# Altium schematic sheet PWM_Controller.SchDoc
size A4; SheetNumber: 11; SheetTotal: 12
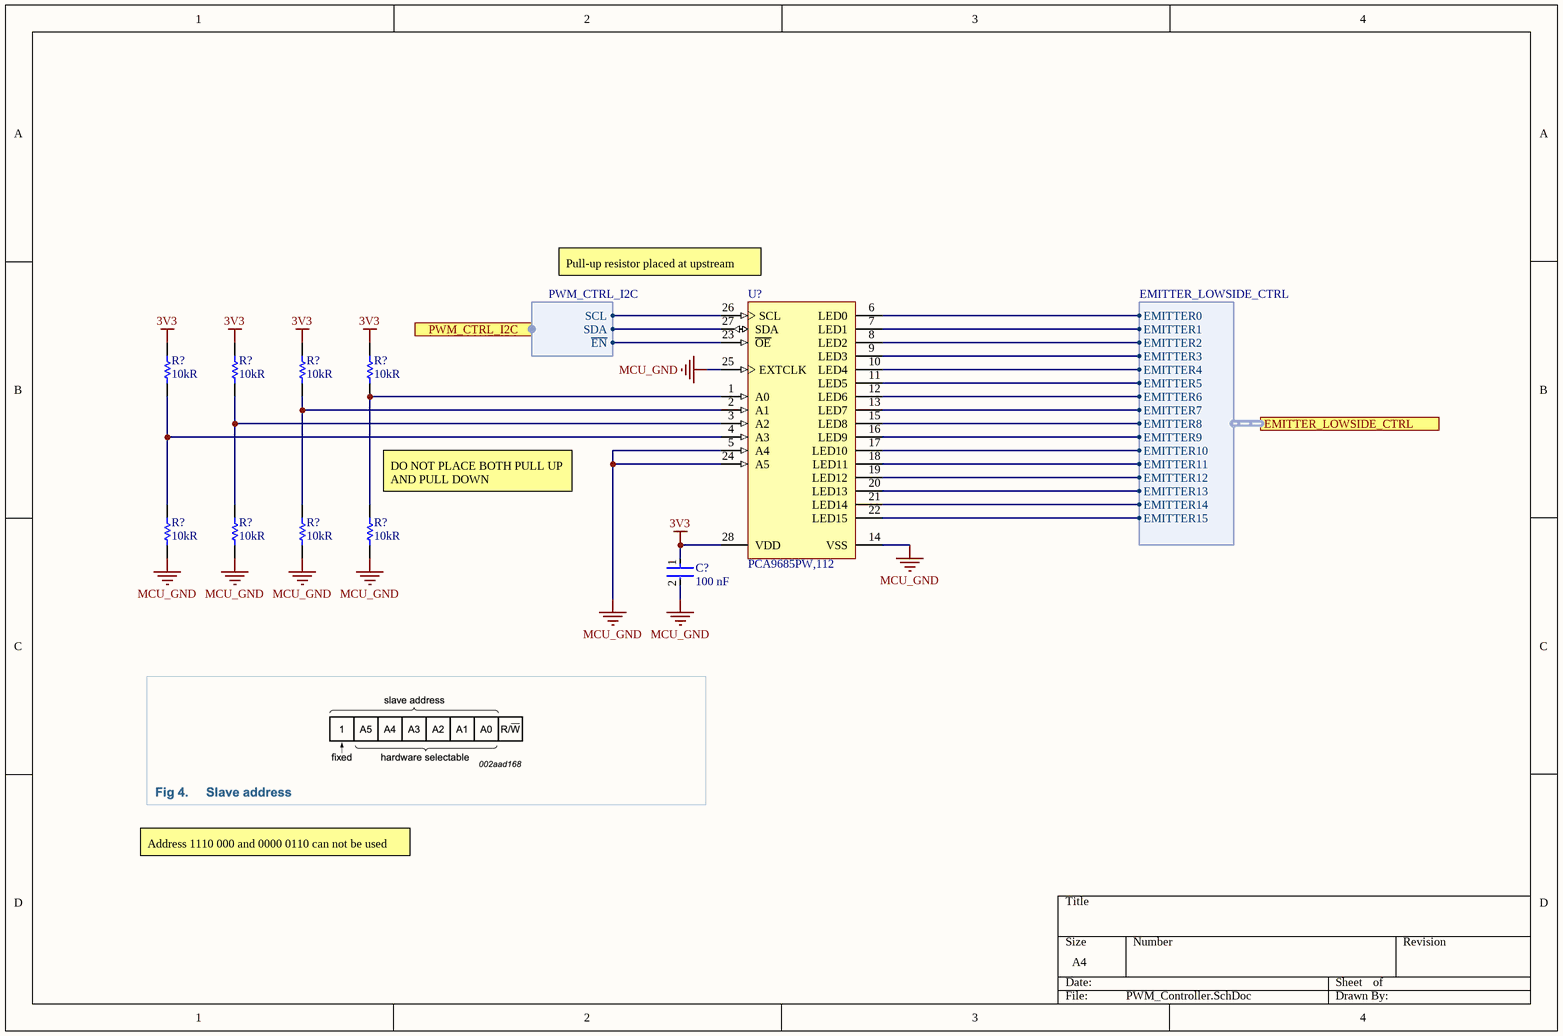
[diagram p0: PWM_Controller.SchDoc]

## Parts
(Parts that share a designator on the sheet are numbered #1, #2 ... from top to bottom, then left to right.)
C?  Capacitance: 100 nF  [FP-CC0603-DA-MFG]  (hidden comment: CC0603KRX7R7BB104)
R?#1  Resistance: 10kR  [RESC1609X50X30NL8T20]  (hidden comment: CRCW060310K0FKEA)
R?#2  Resistance: 10kR  [RESC1609X50X30NL8T20]  (hidden comment: CRCW060310K0FKEA)
R?#3  Resistance: 10kR  [RESC1609X50X30NL8T20]  (hidden comment: CRCW060310K0FKEA)
R?#4  Resistance: 10kR  [RESC1609X50X30NL8T20]  (hidden comment: CRCW060310K0FKEA)
R?#5  Resistance: 10kR  [RESC1609X50X30NL8T20]  (hidden comment: CRCW060310K0FKEA)
R?#6  Resistance: 10kR  [RESC1609X50X30NL8T20]  (hidden comment: CRCW060310K0FKEA)
R?#7  Resistance: 10kR  [RESC1609X50X30NL8T20]  (hidden comment: CRCW060310K0FKEA)
R?#8  Resistance: 10kR  [RESC1609X50X30NL8T20]  (hidden comment: CRCW060310K0FKEA)
U?  PCA9685PW,112  [SOT361-1_V]

## Ports
EMITTER_LOWSIDE_CTRL (harness EMITTER_LOWSIDE_CTRL), PWM_CTRL_I2C (harness PWM_CTRL_I2C)

## Harnesses
PWM_CTRL_I2C: SCL, SDA, ~{EN}
EMITTER_LOWSIDE_CTRL: EMITTER0, EMITTER1, EMITTER2, EMITTER3, EMITTER4, EMITTER5, EMITTER6, EMITTER7, EMITTER8, EMITTER9, EMITTER10, EMITTER11, EMITTER12, EMITTER13, EMITTER14, EMITTER15

## Nets
3V3: C?.1 R?#1.2 R?#2.2 R?#3.2 R?#4.2 U?.28(VDD)
MCU_GND: C?.2 R?#5.1 R?#6.1 R?#7.1 R?#8.1 U?.5(A4) U?.14(VSS) U?.24(A5) U?.25(EXTCLK)
NetR?#1_1: R?#1.1 R?#5.2 U?.4(A3)
NetR?#2_1: R?#2.1 R?#6.2 U?.3(A2)
NetR?#3_1: R?#3.1 R?#7.2 U?.2(A1)
NetR?#4_1: R?#4.1 R?#8.2 U?.1(A0)
NetU?_6: U?.6(LED0) ; port EMITTER_LOWSIDE_CTRL.EMITTER0
NetU?_7: U?.7(LED1) ; port EMITTER_LOWSIDE_CTRL.EMITTER1
NetU?_8: U?.8(LED2) ; port EMITTER_LOWSIDE_CTRL.EMITTER2
NetU?_9: U?.9(LED3) ; port EMITTER_LOWSIDE_CTRL.EMITTER3
NetU?_10: U?.10(LED4) ; port EMITTER_LOWSIDE_CTRL.EMITTER4
NetU?_11: U?.11(LED5) ; port EMITTER_LOWSIDE_CTRL.EMITTER5
NetU?_12: U?.12(LED6) ; port EMITTER_LOWSIDE_CTRL.EMITTER6
NetU?_13: U?.13(LED7) ; port EMITTER_LOWSIDE_CTRL.EMITTER7
NetU?_15: U?.15(LED8) ; port EMITTER_LOWSIDE_CTRL.EMITTER8
NetU?_16: U?.16(LED9) ; port EMITTER_LOWSIDE_CTRL.EMITTER9
NetU?_17: U?.17(LED10) ; port EMITTER_LOWSIDE_CTRL.EMITTER10
NetU?_18: U?.18(LED11) ; port EMITTER_LOWSIDE_CTRL.EMITTER11
NetU?_19: U?.19(LED12) ; port EMITTER_LOWSIDE_CTRL.EMITTER12
NetU?_20: U?.20(LED13) ; port EMITTER_LOWSIDE_CTRL.EMITTER13
NetU?_21: U?.21(LED14) ; port EMITTER_LOWSIDE_CTRL.EMITTER14
NetU?_22: U?.22(LED15) ; port EMITTER_LOWSIDE_CTRL.EMITTER15
NetU?_23: U?.23(~{OE}) ; harness PWM_CTRL_I2C.~{EN}
NetU?_26: U?.26(SCL) ; harness PWM_CTRL_I2C.SCL
NetU?_27: U?.27(SDA) ; harness PWM_CTRL_I2C.SDA

## Notes on the sheet
- (near U?) Pull-up resistor placed at upstream circuitry
- (near R?#8) DO NOT PLACE BOTH PULL UP AND PULL DOWN
- Address 1110 000 and 0000 0110 can not be used

## Library data of the parts
C? = CMP-2000-05002-2: CAP CER 0.1UF 16V X7R 0603; Manufacturer: YAGEO; Tolerance: 0.1; Value: 100 nF; Temperature Coefficient: 15%; Material: Ceramic; Voltage Rating: 16 V; Package: CC0603-DA; ComponentLink2Description: Datasheet; Octopart: https://octopart.com/cc0603krx7r7bb104-yageo-192941; Temperature Range High: +125°C; Digikey Description: CAP CER 0.1UF 16V X7R 0603; Voltage: 16 V; Device Class L2: Capacitors; Height: 0.9mm; Temperature: -55°C to +125°C; Manufacturer Part Number: CC0603KRX7R7BB104; Device Class L1: Passive Components; Device Class L3: Ceramic Capacitors; ComponentLink2URL: http://www.yageo.com/documents/recent/UPY-GPHC_X7R_6.3V-to-50V_18.pdf; Footprint Url: http://www.yageo.com/exep/pages/download/literatures/UPY-C_GEN_24.pdf; RoHS: TRUE; Temperature Range Low: -55°C; Temperature Characteristic: X7R; Lead Free: Yes; Category: Cap; Mouser Description: Multilayer Ceramic Capacitor, CC Series, 0.1 - F, - 10%, X7R, 16 V, 0603 [1608 Metric]; Automotive: No
R?#1-R?#8 = CMP-1666-00005-4: Chip Resistor, 10 KOhm, +/- 1%, 100 mW, -55 to 155 degC, 0603 (1608 Metric), RoHS, Tape and Reel; Manufacturer: Vishay Semiconductor; Voltage Rating: 75 V; Max Operating Temperature: 155 degC; PackageDescription: 2-Pin Surface Mount Device, Body 1.575 x 0.85 mm; ComponentLink1Description: Manufacturer URL; RoHSCompliant: true; PackageReference: 0603; REACH SVHC: Unknown; Length: 1.55 mm; DatasheetVersion: 06/2012; Packaging: Tape and Reel; Min Operating Temperature: -55 degC; Mounting Technology: Surface Mount; ComponentLink2URL: https://datasheet.ciiva.com/11809/0900766b80d98afc-11809037.pdf; Height: 0.45 mm; ComponentLink2Description: Datasheet; Package Quantity: 5000; ComponentLink1URL: http://www.vishay.com/
U? = CMP-1595-00004-2: 16-Channel, 12-Bit PWM Fm+ I2C-Bus LED Controller, 2.3 to 5.5 V, -40 to 85 degC, 28-Pin TSSOP (SOT361-1), RoHS, Tape and Reel; Supply Current Max: 10 mA; Supply Voltage Min: 2.3 V; Supply Voltage Max: 5.5 V; Frequency: 25000000 Hz; Temperature Min: -40 degC; PackageDescription: 28-Pin Small Outline Package, Body 9.7 x 4.4 mm, Pitch 0.65 mm; RoHS: TRUE; ComponentLink1Description: Manufacturer URL; Code_JEDEC: MO-153; PartNumber: PCA9685; ComponentLink2URL: http://www.nxp.com/documents/data_sheet/PCA9685.pdf; Packing: Tape and Reel; ComponentLink1URL: http://www.nxp.com/; ComponentLink3Description: Package Specification; ComponentLink2Description: Datasheet; ComponentLink3URL: http://www.nxp.com/documents/outline_drawing/sot361-1_po.pdf; DatasheetVersion: Rev. 4; Temperature Max: 85 degC; PackageVersion: 02/2003; Mounting Technology: Surface Mount